# Altium schematic sheet Sensors.SchDoc
size Letter
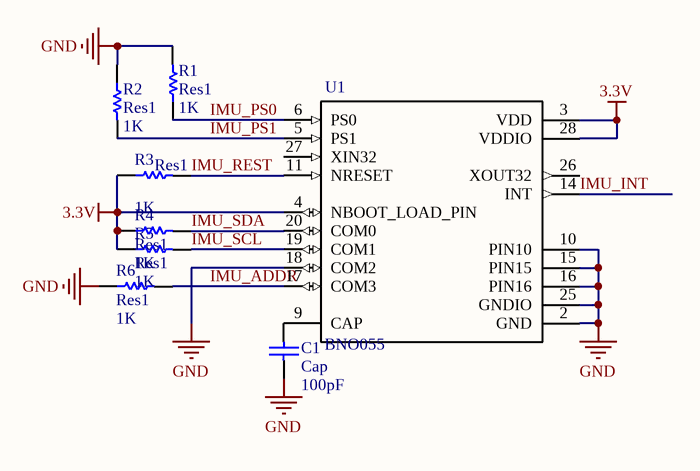
[diagram p0: Sensors.SchDoc]

## Parts
C1  Cap  value 100pF  [RAD-0.3]
R1  Res1  value 1K  [AXIAL-0.3]
R2  Res1  value 1K  [AXIAL-0.3]
R3  Res1  value 1K  [AXIAL-0.3]
R4  Res1  value 1K  [AXIAL-0.3]
R5  Res1  value 1K  [AXIAL-0.3]
R6  Res1  value 1K  [AXIAL-0.3]
U1  BNO055  [*LGA28R50P4X10_380X520X100]

## Nets
3.3V: R3.1 R4.1 R5.1 U1.3(VDD) U1.4(NBOOT_LOAD_PIN) U1.28(VDDIO)
GND: C1.1 R1.2 R2.1 R6.1 U1.2(GND) U1.10(PIN10) U1.15(PIN15) U1.16(PIN16) U1.18(COM2) U1.25(GNDIO)
IMU_ADDR: R6.2 U1.17(COM3)
IMU_INT: U1.14(INT)
IMU_PS0: R1.1 U1.6(PS0)
IMU_PS1: R2.2 U1.5(PS1)
IMU_REST: R3.2 U1.11(NRESET)
IMU_SCL: R5.2 U1.19(COM1)
IMU_SDA: R4.2 U1.20(COM0)
NetC1_2: C1.2 U1.9(CAP)

Not connected (* = marked no-connect by the designer): U1 26(XOUT32) 27(XIN32)

## Library data of the parts
C1 = Cap: Capacitor; Published: 8-Jun-2000; LatestRevisionDate: 17-Jul-2002; LatestRevisionNote: Re-released for DXP Platform.; PackageReference: RAD-0.3; Publisher: Altium Limited; PackageDescription: Radial Cap, Thru-Hole; 2 Leads; 0.3 in Pin Spacing
R1-R6 = Res1: Resistor; Published: 8-Jun-2000; LatestRevisionDate: 17-Jul-2002; LatestRevisionNote: Re-released for DXP Platform.; PackageReference: AXIAL-0.3; Publisher: Altium Limited; PackageDescription: Axial Device, Thru-Hole; 2 Leads; 0.3 in Pin Spacing
U1 = BNO055: BNO055 9-axis Absolute Orientation Sensor _ SiP _ w/Sensors and Sensor Fusion; MF: Bosch; MP: BNO055; Price: None; SnapEDA_Link: https://www.snapeda.com/parts/BNO055/Bosch%20Sensortec/view-part/?ref=snap; Package: LGA-28 Bosch; Availability: Unavailable; Value: *